# Altium schematic sheet BaseStation.SchDoc
size A; SheetNumber: 1
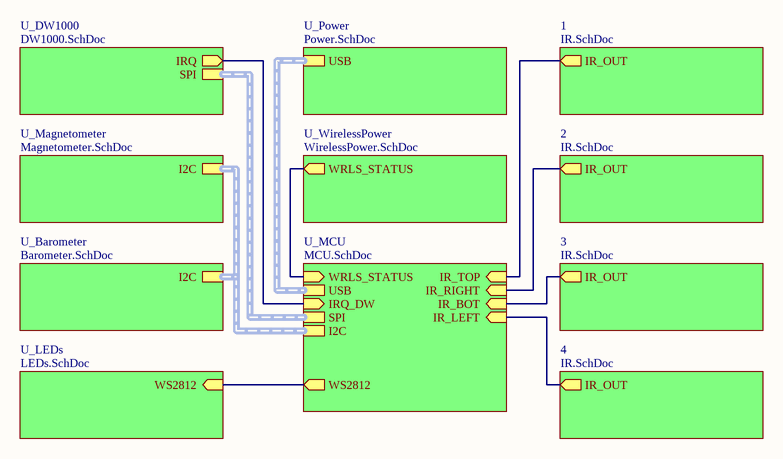
[diagram p0: BaseStation.SchDoc]

## Sub-sheets
1 = IR.SchDoc: IR_OUT (out)
2 = IR.SchDoc: IR_OUT (out)
3 = IR.SchDoc: IR_OUT (out)
4 = IR.SchDoc: IR_OUT (out)
U_Barometer = Barometer.SchDoc: I2C (harness I2C)
U_DW1000 = DW1000.SchDoc: SPI (harness SPI), IRQ (out)
U_LEDs = LEDs.SchDoc: WS2812 (in)
U_Magnetometer = Magnetometer.SchDoc: I2C (harness I2C)
U_MCU = MCU.SchDoc: USB (harness USB), I2C (harness I2C), SPI (harness SPI), WRLS_STATUS (in), IRQ_DW (in), WS2812 (out), IR_TOP (in), IR_BOT (in), IR_LEFT (in), IR_RIGHT (in)
U_Power = Power.SchDoc: USB (harness USB)
U_WirelessPower = WirelessPower.SchDoc: WRLS_STATUS (out)

## Nets
(unnamed): sheet U_MCU/WRLS_STATUS, sheet U_WirelessPower/WRLS_STATUS
(unnamed): sheet U_MCU/IRQ_DW, sheet U_DW1000/IRQ
(unnamed): sheet U_MCU/WS2812, sheet U_LEDs/WS2812
(unnamed): sheet U_MCU/IR_TOP, sheet 1/IR_OUT
(unnamed): sheet U_MCU/IR_BOT, sheet 3/IR_OUT
(unnamed): sheet U_MCU/IR_LEFT, sheet 4/IR_OUT
(unnamed): sheet U_MCU/IR_RIGHT, sheet 2/IR_OUT

## Buses and harness runs
harness sheet U_Barometer/I2C = sheet U_Magnetometer/I2C = sheet U_MCU/I2C
harness sheet U_DW1000/SPI = sheet U_MCU/SPI
harness sheet U_MCU/USB = sheet U_Power/USB